# Altium schematic sheet pwr_phase.schdoc
size A4
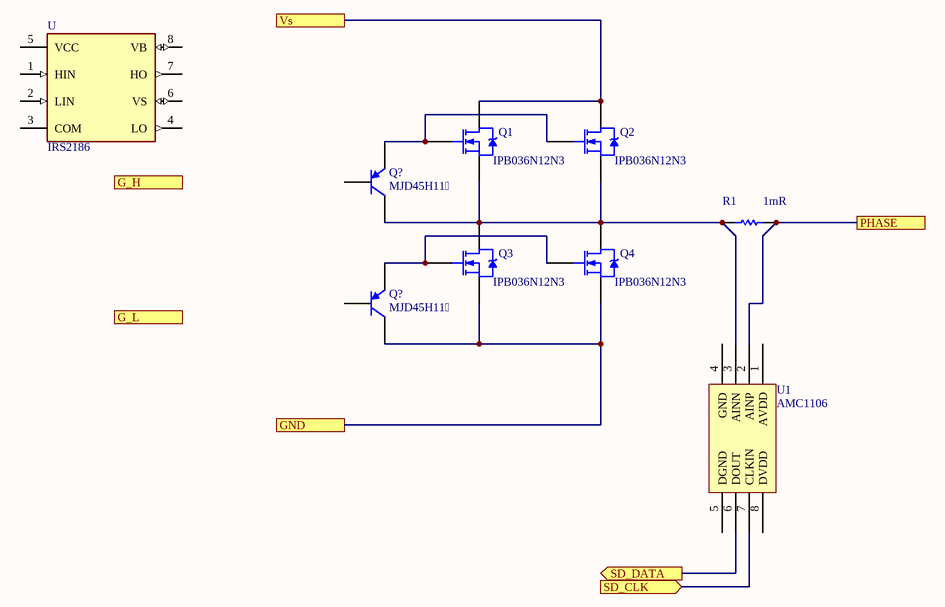
[diagram p0: pwr_phase.schdoc]

## Parts
(Parts that share a designator on the sheet are numbered #1, #2 ... from top to bottom, then left to right.)
Q1  IPB036N12N3  [TO263-7]
Q2  IPB036N12N3  [TO263-7]
Q3  IPB036N12N3  [TO263-7]
Q4  IPB036N12N3  [TO263-7]
Q?#1  MJD45H11  [TO-252AA]
Q?#2  MJD45H11  [TO-252AA]
R1  1mR  [RES_CSS2H-3920R]
U  IRS2186  [SOIC-8]
U1  AMC1106  [*SOIC127P1150X280-8N]

## Ports
G_H (out), G_L (out), GND, PHASE, SD_CLK (in), SD_DATA (out), Vs

## Nets
GND: Q3.3(S) Q4.3(S) Q?#2.2(C) ; port GND
PHASE: R1.2 U1.2(AINP) ; port PHASE
SD_CLK: U1.7(CLKIN) ; port SD_CLK
SD_DATA: U1.6(DOUT) ; port SD_DATA
Vs: Q1.2(D) Q2.2(D) ; port Vs
NetQ1_1: Q1.1(G) Q2.1(G) Q?#1.3(E)
NetQ1_3: Q1.3(S) Q2.3(S) Q3.2(D) Q4.2(D) Q?#1.2(C) R1.1 U1.3(AINN)
NetQ3_1: Q3.1(G) Q4.1(G) Q?#2.3(E)

Not connected (* = marked no-connect by the designer): Q?#1 1(B); Q?#2 1(B); U 1(HIN) 2(LIN) 3(COM) 4(LO) 5(VCC) 6(VS) 7(HO) 8(VB); U1 1(AVDD) 4(GND) 5(DGND) 8(DVDD)

## Library data of the parts
Q1-Q4 = NMOS-2: N-Channel Power MOSFET; Note: Pin 2 is electrically connected to pin 4.; Published: 8-Jun-2000; LatestRevisionDate: 17-Jul-2002; LatestRevisionNote: Re-released for DXP Platform.; DatasheetVersion: PD-9.814; PackageVersion: Feb-1997; PackageReference: TO-220AB; Publisher: Altium Limited; PackageDescription: TO, Thru-Hole, Vertical, Heatsink Mounted; 3 In-Line Leads; Pitch 2.54 mm; ComponentLink1Description: Manufacturer Link; ComponentLink1URL: http://www.irf.com/
Q?#1 Q?#2 = PNP: PNP Bipolar Transistor; Published: 8-Jun-2000; LatestRevisionDate: 29-May-2009; LatestRevisionNote: IPC-7351 Footprint Added.; PackageVersion: Aug-1999; PackageReference: SOT-23B; Publisher: Altium Limited; PackageDescription: 3-Pin SOT-23 Package 0.95 mm Pitch, 2.4 mm Lead Span
R1 = Res1: Resistor; Published: 8-Jun-2000; LatestRevisionDate: 17-Jul-2002; LatestRevisionNote: Re-released for DXP Platform.; PackageReference: AXIAL-0.3; Publisher: Altium Limited; PackageDescription: Axial Device, Thru-Hole; 2 Leads; 0.3 in Pin Spacing
U = IRS2186: MF: International Rectifier; SnapEDA_Link: https://www.snapeda.com/parts/IRS2186/International%20Rectifier/view-part/2895040/?ref=snap; Price: None; MP: IRS2186; Value: *; Availability: Unavailable; Package: None